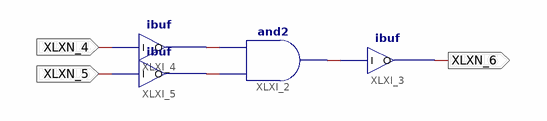
[diagram p0: schematic sheet 1]
// Xilinx ISE schematic main.sch (spartan6) as structural Verilog: 4 symbols, 3 ports
module main (
  input  XLXN_4,
  input  XLXN_5,
  output XLXN_6
);

  wire XLXN_1, XLXN_2, XLXN_3;

  and XLXI_2 (XLXN_3, XLXN_2, XLXN_1);
  ibuf XLXI_3 (.I(XLXN_3), .O(XLXN_6));
  ibuf XLXI_4 (.I(XLXN_4), .O(XLXN_1));
  ibuf XLXI_5 (.I(XLXN_5), .O(XLXN_2));
endmodule
